# Altium schematic sheet SecurityLock.SchDoc
size A4
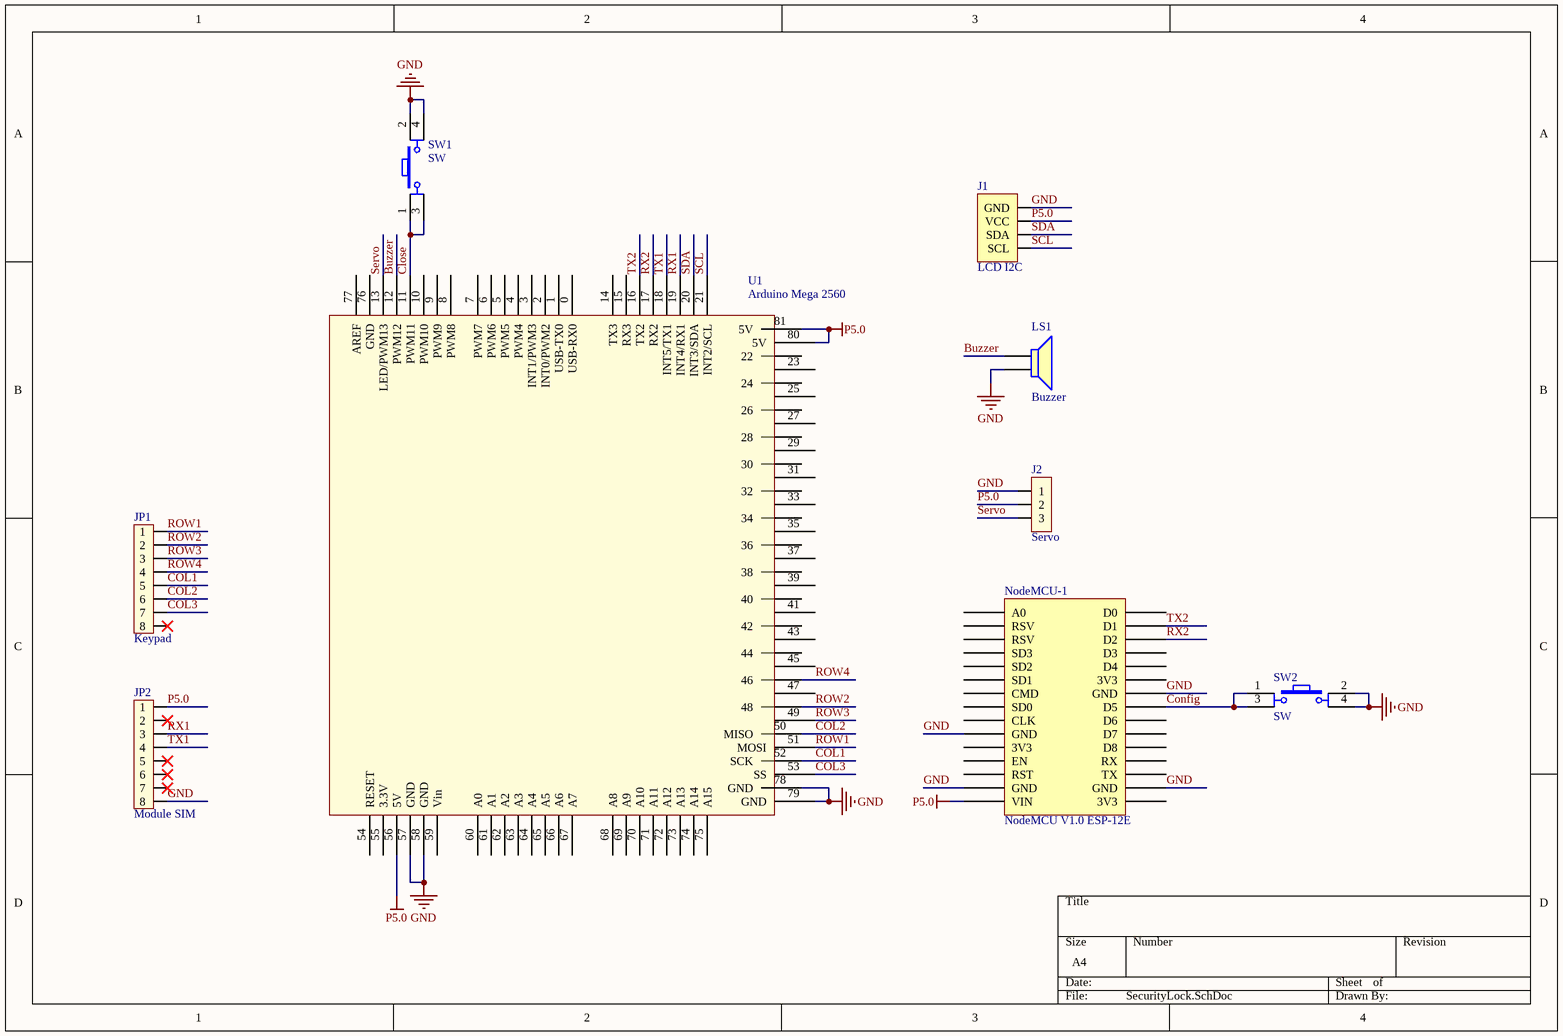
[diagram p0: SecurityLock.SchDoc]

## Parts
J1  LCD I2C  [LCD16x2_I2C]
J2  Servo  [JP3]
JP1  Keypad  [JP8]
JP2  Module SIM  [JP8]
LS1  Buzzer  [Buzzer]
NodeMCU-1  NodeMCU V1.0 ESP-12E  [NodeMCU V1.0 ESP-12E]
SW1  SW  [SW4]
SW2  SW  [SW4]
U1  Arduino Mega 2560  [Arduino]

## Nets
GND: J1.1(GND) J2.1 JP2.8 LS1.2 NodeMCU-1.GND SW1.2 SW1.4 SW2.2 SW2.4 U1.57(GND) U1.58(GND) U1.78(GND) U1.79(GND)
P5.0: J1.2(VCC) J2.2 JP2.1 NodeMCU-1.VIN U1.56(5V) U1.80(5V) U1.81(5V)
Buzzer: LS1.1 U1.12(PWM12)
Close: SW1.1 SW1.3 U1.11(PWM11)
COL1: JP1.5 U1.52(SCK)
COL2: JP1.6 U1.50(MISO)
COL3: JP1.7 U1.53(SS)
Config: NodeMCU-1.D5 SW2.1 SW2.3
ROW1: JP1.1 U1.51(MOSI)
ROW2: JP1.2 U1.48
ROW3: JP1.3 U1.49
ROW4: JP1.4 U1.46
RX1: JP2.3 U1.19(INT4/RX1)
RX2: NodeMCU-1.D2 U1.17(RX2)
SCL: J1.4(SCL) U1.21(INT2/SCL)
SDA: J1.3(SDA) U1.20(INT3/SDA)
Servo: J2.3 U1.13(LED/PWM13)
TX1: JP2.4 U1.18(INT5/TX1)
TX2: NodeMCU-1.D1 U1.16(TX2)

Not connected (* = marked no-connect by the designer): JP1 8*; JP2 2* 5* 6* 7*; NodeMCU-1 3V3 A0 CLK CMD D0 D3 D4 D6 D7 D8 EN RST RSV RX SD0 SD1 SD2 SD3 TX; U1 0(USB-RX0) 1(USB-TX0) 2(INT0/PWM2) 3(INT1/PWM3) 4(PWM4) 5(PWM5) 6(PWM6) 7(PWM7) 8(PWM8) 9(PWM9) 10(PWM10) 14(TX3) 15(RX3) 22 23 24 25 26 27 28 29 30 31 32 33 34 35 36 37 38 39 40 41 42 43 44 45 47 54(RESET) 55(3.3V) 59(Vin) 60(A0) 61(A1) 62(A2) 63(A3) 64(A4) 65(A5) 66(A6) 67(A7) 68(A8) 69(A9) 70(A10) 71(A11) 72(A12) 73(A13) 74(A14) 75(A15) 76(GND) 77(AREF)

## Library data of the parts
J2 = JP3: Jumper 3; Value: J3
JP1 JP2 = JP8: JP8 PIN; Value: JP7
LS1 = Buzzer: Magnetic Transducer Buzzer; Designed By: John MacTavish; LatestRevisionNote: Schematic revised, PCB Footprint replaced.; PackageReference: ABSM-1574; ComponentLink1Description: Manufacturer Link; ComponentLink1URL: http://www.megastar.com/linecard/buzzmode/index.php
NodeMCU-1 = NodeMCU V1.0 ESP-12E: NodeMCU V1.0 ESP8266 (ESP-12E)
SW1 SW2 = SW4: Switch button 4 pin; Value: Button chip 4 pin